# EAGLE design Qwiic_UV_Sensor_VEML6075 (EAGLE 9.0.0)
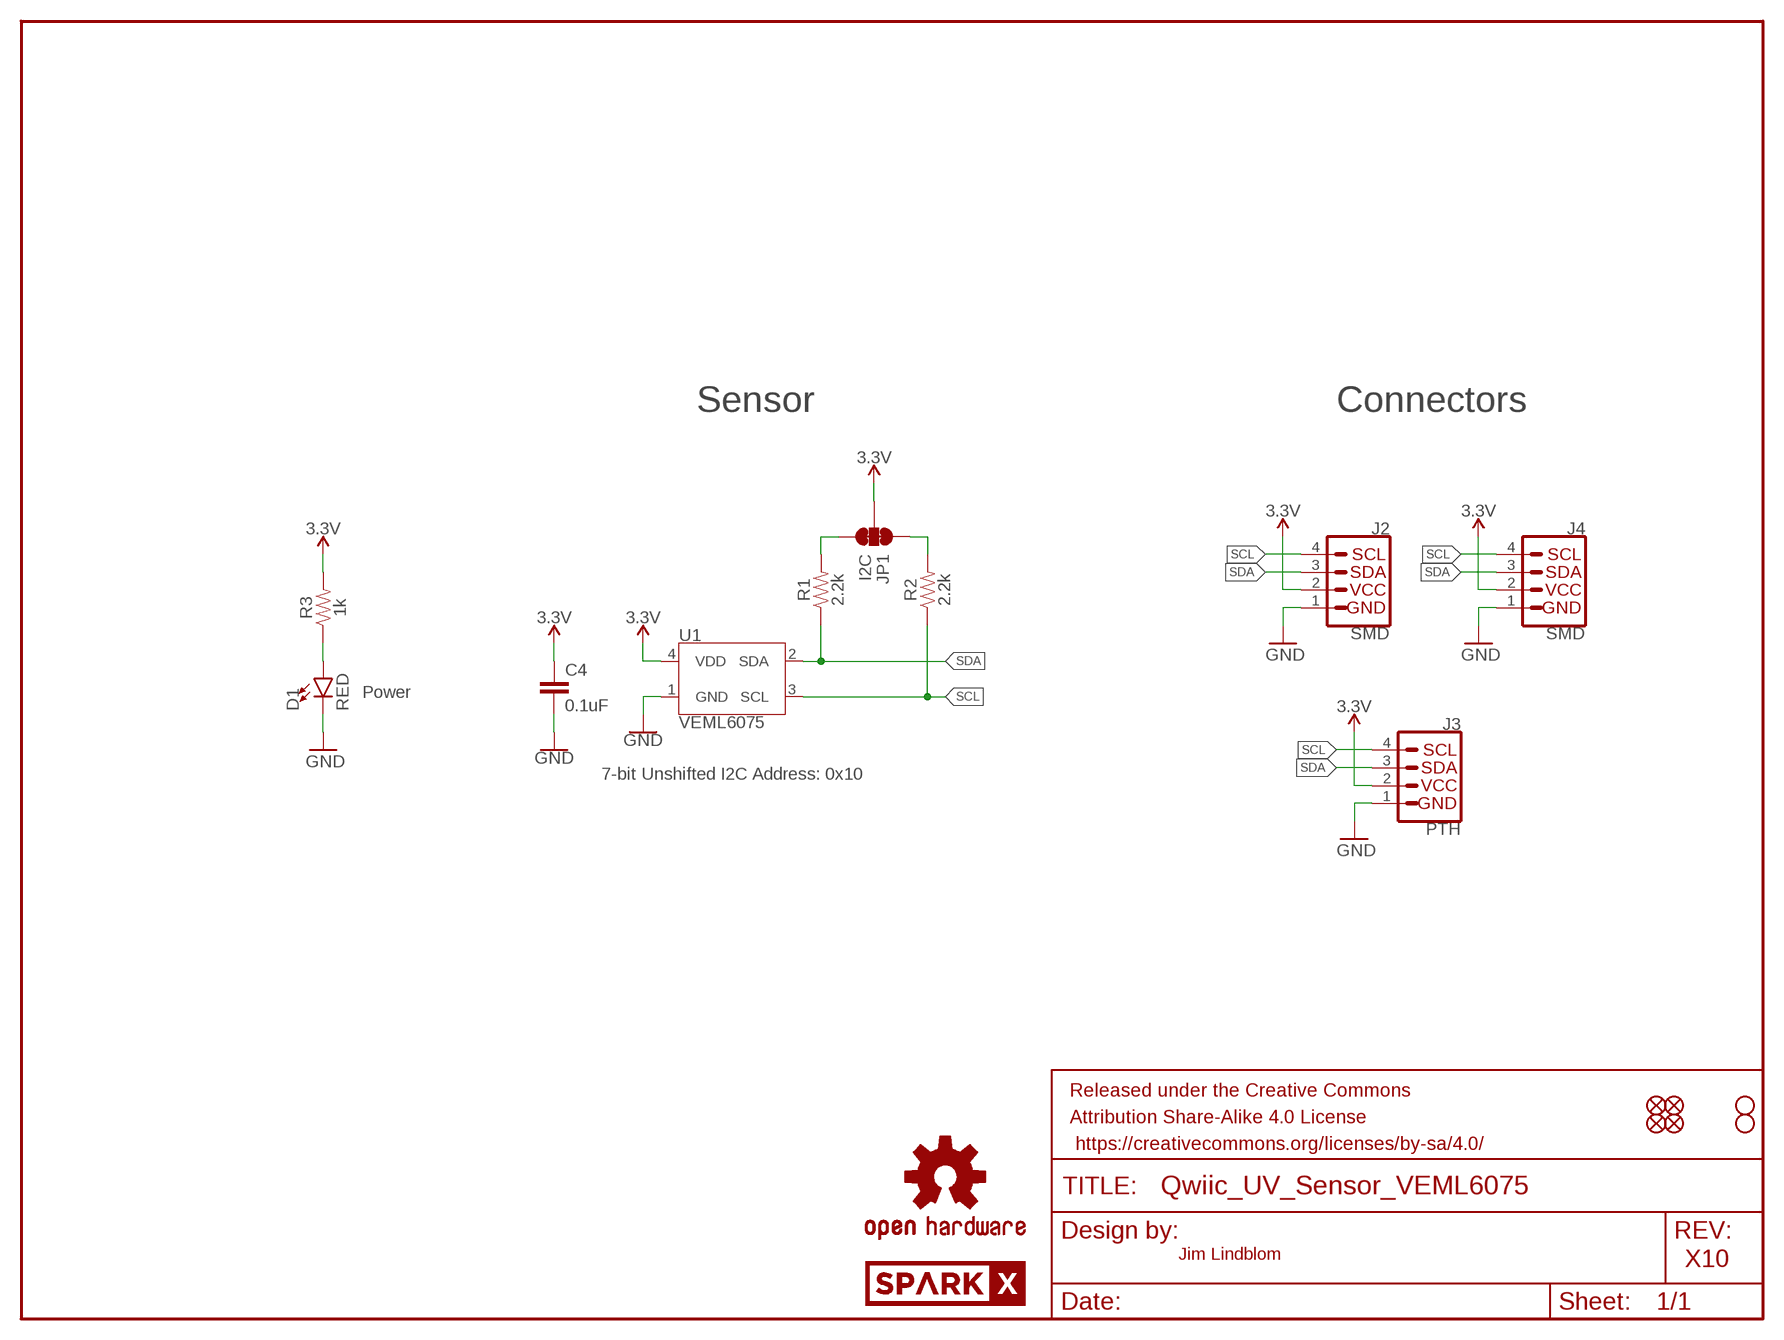
[diagram p0: schematic, sheet 1]

## Parts
C4  0.1uF  0.1UF-0603-25V-(+80/-20%)  [0603]
D1  RED  LED-RED0603  [LED-0603]
FRAME1  FRAME-LETTER  [CREATIVE_COMMONS]
J2  SMD  I2C_STANDARDJS-1MM  [1X04_1MM_RA]
J3  PTH  I2C_STANDARD_NO_SILK  [1X04_NO_SILK]
J4  SMD  I2C_STANDARDJS-1MM  [1X04_1MM_RA]
JP1  I2C  JUMPER-SMT_3_2-NC_TRACE_SILK  [SMT-JUMPER_3_2-NC_TRACE_SILK]
JP2  FIDUCIALUFIDUCIAL  [MICRO-FIDUCIAL]
JP3  STAND-OFF  [STAND-OFF]
JP4  STAND-OFF  [STAND-OFF]
JP5  FIDUCIALUFIDUCIAL  [MICRO-FIDUCIAL]
JP6  FIDUCIALUFIDUCIAL  [MICRO-FIDUCIAL]
JP7  FIDUCIALUFIDUCIAL  [MICRO-FIDUCIAL]
LOGO1  OSHW-LOGOMINI  [OSHW-LOGO-MINI]
R1  2.2k  2.2KOHM-0603-1/10W-1%  [0603]
R2  2.2k  2.2KOHM-0603-1/10W-1%  [0603]
R3  1k  1KOHM-0603-1/10W-1%  [0603]
U1  VEML6075  [VEML6075_A3OP]
U$1  SPARKX-LOGO4  [SPARKX-MEDIUM]
U$2  SPARKX-LOGO4  [SPARKX-MEDIUM]

## Nets
3.3V: C4.1 J2.2(VCC) J3.2(VCC) J4.2(VCC) JP1.2 R3.2 U1.4(VDD)
GND: C4.2 D1.C J2.1(GND) J3.1(GND) J4.1(GND) U1.1(GND)
N$3: D1.A R3.1
N$4: JP1.3 R1.2
N$5: JP1.1 R2.2
SCL: J2.4(SCL) J3.4(SCL) J4.4(SCL) R2.1 U1.3(SCL)
SDA: J2.3(SDA) J3.3(SDA) J4.3(SDA) R1.1 U1.2(SDA)

## Notes on the sheet
- Sensor | Connectors
- Power
- 7-bit Unshifted I2C Address: 0x10
- Jim Lindblom
- X10

## Library data of the parts
C4 = SparkFun-Capacitors:0.1UF: 0.1µF ceramic capacitors A capacitor is a passive two-terminal electrical component used to store electrical energy temporarily in an electric field.; PROD_ID: CAP-00810
D1 = SparkFun-LED:LED-RED: Red SMD LED Used in manufacturing of most products at SparkFun Packages: 0603 - SMD 0603 package [Product Link] <http://docs.avagotech.com/docs/AV02-0551EN> 0603 SMART - SMD 0603 SMART package ( more efficient and expensive)[Product Link] <http://www.osram-os.com/Graphics/XPic2/00077099_0.pdf> 1206 - SMD1206 package [Product Link] <https://www.sparkfun.com/datasheets/DevTools/LilyPad/Q150OVS4.pdff> SparkFun Products: Pro Mini 328 -5V <https://www.sparkfun.com/products/821> RedBoard <https://www.sparkfun.com/products/12757> IOIO-OTG <https://www.sparkfun.com/products/13613>; PROD_ID: DIO-00819
FRAME1 = SparkFun-Aesthetics:FRAME-LETTER: Schematic Frame - Letter Standard 8.5x11 US Letter frame
J2-J4 = SparkX:I2C_STANDARD: SparkFun I2C Standard Pinout Header SparkFun has standardized on a pinout for all I2C based sensor breakouts. This pinout allows I2C boards to be plugged directly into the headers on Arduino Uno compatible boards, and to be daisy chained easily. Example SparkFun Products: SparkFun Atmospheric Sensor Breakout - BME280 <https://www.sparkfun.com/products/13676> SparkFun Altitude/Pressure Sensor Breakout - MPL3115A2 <https://www.sparkfun.com/products/11084> SparkFun TOF Range Finder Sensor - VL6180 <https://www.sparkfun.com/products/12785>
JP1 = SparkFun-Jumpers:JUMPER-SMT_3_2-NC_TRACE: Normally closed trace jumper (2 of 2 connections) This jumper has a trace between all three pads so they are normally closed (NC). Use a razor knife to open the connection(s). For best results follow the IPC guidelines for cutting traces: Cutout at least 0.063 mm (0.005 in). Remove all loose material to clean up the cut area. Seal the cut with an approved epoxy. Reapply solder to reclose the connection(s).
JP2 JP5-JP7 = SparkFun:FIDUCIAL: Fiducial Alignment Points Various fiducial points for machine vision alignment.
JP3 JP4 = SparkFun:STAND-OFF: Stand Off This is the mechanical footprint for a #4 phillips button head screw. Use the keepout ring to avoid running the screw head into surrounding components. SKU : PRT-00447
LOGO1 = SparkFun-Aesthetics:OSHW-LOGO: Open-Source Hardware (OSHW) Logo This logo indicates the piece of hardware it is found on incorporates a OSHW license and/or adheres to the definition of open source hardware found here: http://freedomdefined.org/OSHW
R1 R2 = SparkFun-Resistors:2.2KOHM: 2.2kΩ resistor A resistor is a passive two-terminal electrical component that implements electrical resistance as a circuit element. Resistors act to reduce current flow, and, at the same time, act to lower voltage levels within circuits. - Wikipedia; PROD_ID: RES-08272
R3 = SparkFun-Resistors:1KOHM: 1kΩ resistor A resistor is a passive two-terminal electrical component that implements electrical resistance as a circuit element. Resistors act to reduce current flow, and, at the same time, act to lower voltage levels within circuits. - Wikipedia; PROD_ID: RES-07856
U1 = Qwiic_UV_Sensor_VEML6075:VEML6075: Vishay VEML6075 UVA and UVB light sensor with I2C interface.
U$1 U$2 = SparkX:SPARKX-LOGO

## Board
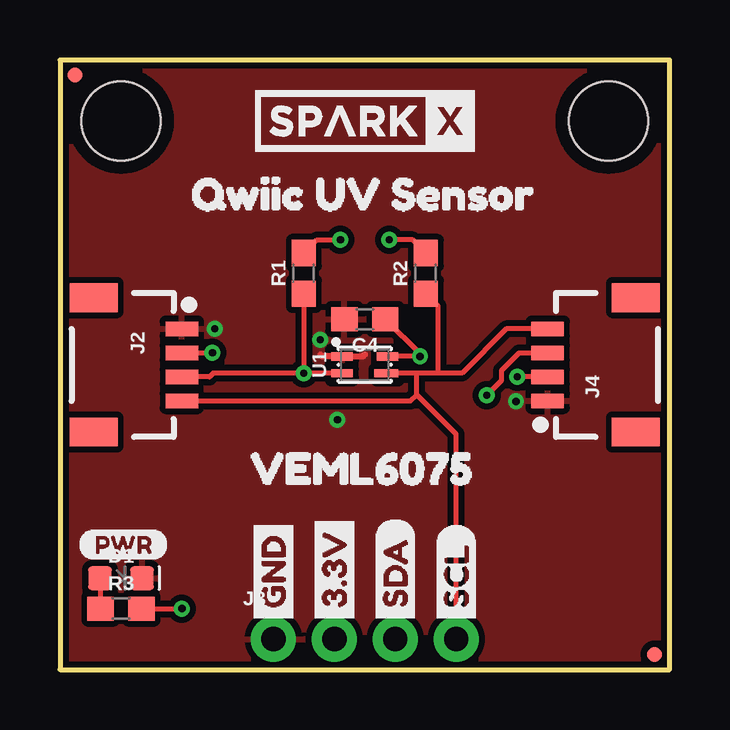
[diagram p1: board, top side]
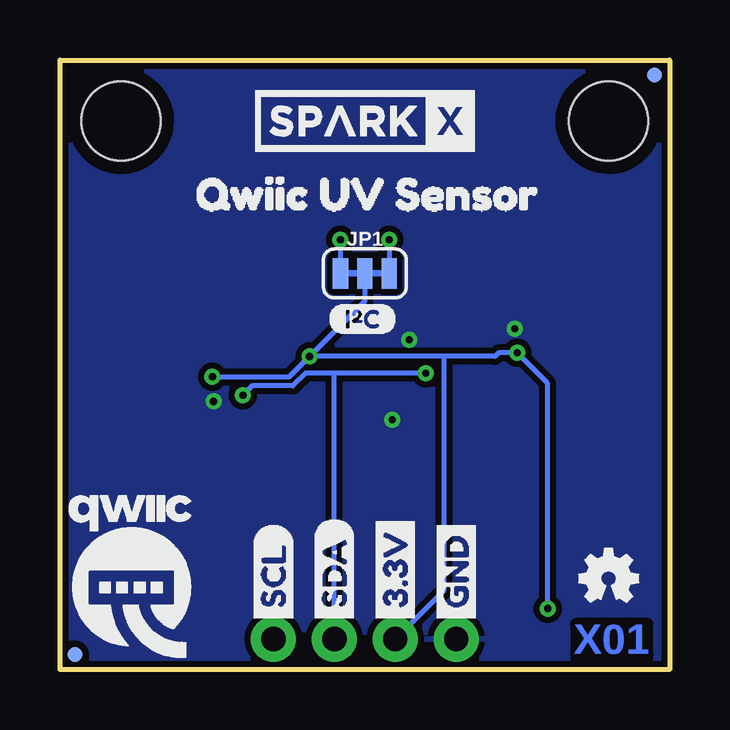
[diagram p2: board, bottom side, seen from below]

Size 25.4 x 25.4 mm. Coordinates in mm from the lower left corner, seen from the top.
Outline: 0,0 25.4,0 25.4,25.4 0,25.4 0,0
Copper layers (1*16): Top 0.035mm / dielectric 1.5mm / Bottom 0.035mm
Design rules "SparkFun-2-layer-PCBWay-LIMIT": minimum track width 6mil, minimum drill 0.3mm, track to track 6mil, track to pad 6mil, pad to pad 6mil, via to via 6mil, smd to smd 6mil, copper to edge 6mil, drill to drill 6mil, minimum pad ring 7mil, minimum via ring 7mil, stop-mask expansion 4mil, vias tented up to drill 25mil, thermal gap 10mil

### Footprints (pad centres in the part's own frame; a part is rotated, then mirrored left to right if it is on the bottom)
0603 = smd 1.1 x 1: 1 -0.85,0; 2 0.85,0
LED-0603 = smd 1 x 1: A -0.877,0; C 0.877,0
1X04_1MM_RA = smd 0.6 x 1.35: 1 -1.5,0; 2 -0.5,0; 3 0.5,0; 4 1.5,0 | smd 1.2 x 2: NC1 2.8,-3.675; NC2 -2.8,-3.675
1X04_NO_SILK = drill 1.016 pad 1.88: 1 0,0; 2 2.54,0; 3 5.08,0; 4 7.62,0
SMT-JUMPER_3_2-NC_TRACE_SILK = smd 0.635 x 1.27: 1 -1.016,0; 2 0,0; 3 1.016,0
MICRO-FIDUCIAL = smd 0.635 x 0.635: 1 0,0
STAND-OFF = hole 3.302: 0,0
VEML6075_A3OP = smd 0.9 x 0.35: 1 -0.95,0.35; 2 -0.95,-0.35; 4 0.95,0.35 | smd 1 x 0.35: 3 0.9,-0.35

### Placement (x,y rotation side)
C4  12.7,14.61 180 top
D1  2.54,3.81 0 top
FRAME1  -8.89,-11.43 0 top  (outside the outline)
J2  5.08,12.7 270 top
J3  8.89,1.27 0 top
J4  20.32,12.7 90 top
JP1  12.7,16.51 0 bottom
JP2  24.77,0.64 0 bottom
JP3  2.54,22.86 0 top
JP4  22.86,22.86 90 top
JP5  24.77,0.64 0 top
JP6  0.64,24.77 0 top
JP7  0.64,24.77 0 bottom
LOGO1  2.54,3.81 0 bottom
R1  10.16,16.51 90 top
R2  15.24,16.51 90 top
R3  2.54,2.54 0 top
U1  12.7,12.7 0 top
U$1  12.7,22.86 0 top
U$2  12.7,22.86 0 bottom
U$3  [QWIIC-LOGO-MEDIUM]  22.48,3.94 0 bottom
U$4  [GND1]  8.89,1.65 90 bottom
U$5  [QWIIC_UV_SENSOR1]  4.32,19.81 0 top
U$6  [_VEML60750]  6.35,8.38 0 top
U$7  [3#3V2]  11.43,1.65 90 bottom
U$8  [SDA8]  13.97,1.65 90 bottom
U$9  [SCL9]  16.51,1.65 90 bottom
U$10  [I_SUPER2_C-()-03]  14.22,14.61 0 bottom
U$11  [QWIIC_UV_SENSOR1]  20.9,19.81 0 bottom
U$16  [PWR-()-03]  0.76,5.21 0 top
U$21  [3#3V2]  11.43,1.65 90 top
U$22  [GND1]  8.89,1.65 90 top
U$26  [SCL9]  16.51,1.65 90 top
U$27  [SDA8]  13.97,1.65 90 top

### Tracks (layer width: path | path; a pad name or v marks a point on that pad's centre or on a via)
3.3V  (via drill 0.3)
  Top 0.203: U1.4 v15,13.05 15,13.15 C4.1 | J4.2 v19.05,12.2 | J2.2 v6.35,13.2 | R3.2 v5.08,2.54
  Bottom 0.203: v19.05,12.2 15.85,12.2 v15,13.05 | 9.4,13.05 7.27,13.05 7.12,13.2 v6.35,13.2 5.08,11.93 v5.08,2.54 | 9.4,13.05 v15,13.05 | JP1.2 12.7,15.35 v15,13.05 | J3.2 9.4,3.3 9.4,13.05
GND  (via drill 0.3)
  Top 0.254: 10.85,13.13 10.93,13.05 U1.1 12.62,13.05 12.7,13.13
  other vias: 11.56,10.41 6.45,14.2 19,11.18 10.85,13.74
  pour Top (isolate 0.254): 0,25.4 0,0 25.4,0 25.4,25.4
  pour Bottom (isolate 0.254): 25.4,25.4 25.4,0 0,0 0,25.4
N$3
  Top 0.203: R3.1 1.69,3.78 D1.A
N$4  (via drill 0.3)
  Top 0.203: R1.2 10.71,17.91 v11.68,17.91
  Bottom 0.203: v11.68,17.91 JP1.3
N$5  (via drill 0.3)
  Top 0.203: R2.2 14.69,17.91 v13.72,17.91
  Bottom 0.203: v13.72,17.91 JP1.1
SCL
  Top 0.203: 14.86,11.46 14.86,12.35 | J2.4 14.6,11.2 14.86,11.46 | 15.75,12.35 16.75,12.35 18.6,14.2 J4.4 | 15.75,12.35 14.86,12.35 | 14.86,12.35 U1.3 | R2.1 15.75,15.15 15.75,12.35 | J3.4 16.51,9.81 14.86,11.46
SDA  (via drill 0.3)
  Top 0.203: v10.16,12.35 6.38,12.35 6.23,12.2 J2.3 | R1.1 v10.16,12.35 | v17.78,11.43 18.4,12.05 18.4,12.47 19.13,13.2 J4.3 | U1.2 v10.16,12.35
  Bottom 0.203: v10.16,12.35 13.97,12.35 | 13.97,12.35 15.16,12.35 15.69,11.82 17.39,11.82 v17.78,11.43 | J3.3 13.97,12.35

### Text on the board
Bottom: X01
tDocu: Jim Lindblom